# Altium schematic sheet color_sensors.SchDoc
size A; SheetNumber: 2; SheetTotal: 2
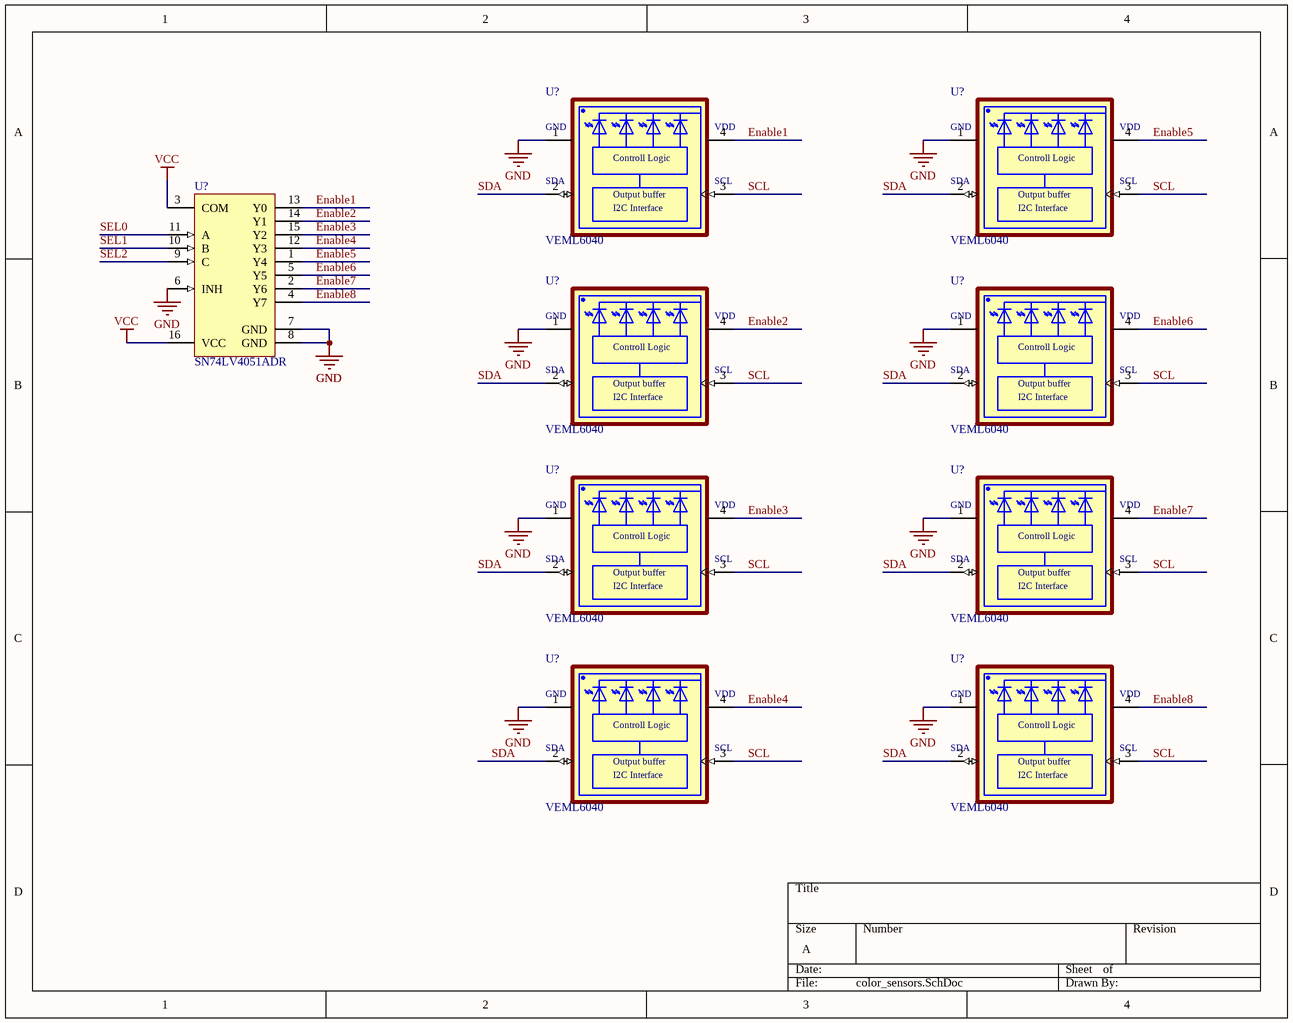
[diagram p0: color_sensors.SchDoc]

## Parts
(Parts that share a designator on the sheet are numbered #1, #2 ... from top to bottom, then left to right.)
U?#1  VEML6040  [VISHAY_VEML6040_1.25X2X1]
U?#2  VEML6040  [VISHAY_VEML6040_1.25X2X1]
U?#3  SN74LV4051ADR  [D0016A_M]
U?#4  VEML6040  [VISHAY_VEML6040_1.25X2X1]
U?#5  VEML6040  [VISHAY_VEML6040_1.25X2X1]
U?#6  VEML6040  [VISHAY_VEML6040_1.25X2X1]
U?#7  VEML6040  [VISHAY_VEML6040_1.25X2X1]
U?#8  VEML6040  [VISHAY_VEML6040_1.25X2X1]
U?#9  VEML6040  [VISHAY_VEML6040_1.25X2X1]

## Nets
GND: U?#1.1(GND) U?#2.1(GND) U?#3.6(INH) U?#3.7(GND) U?#3.8(GND) U?#4.1(GND) U?#5.1(GND) U?#6.1(GND) U?#7.1(GND) U?#8.1(GND) U?#9.1(GND)
VCC: U?#3.3(COM) U?#3.16(VCC)
Enable1: U?#1.4(VDD) U?#3.13(Y0)
Enable2: U?#3.14(Y1) U?#4.4(VDD)
Enable3: U?#3.15(Y2) U?#6.4(VDD)
Enable4: U?#3.12(Y3) U?#8.4(VDD)
Enable5: U?#2.4(VDD) U?#3.1(Y4)
Enable6: U?#3.5(Y5) U?#5.4(VDD)
Enable7: U?#3.2(Y6) U?#7.4(VDD)
Enable8: U?#3.4(Y7) U?#9.4(VDD)
SCL: U?#1.3(SCL) U?#2.3(SCL) U?#4.3(SCL) U?#5.3(SCL) U?#6.3(SCL) U?#7.3(SCL) U?#8.3(SCL) U?#9.3(SCL)
SDA: U?#1.2(SDA) U?#2.2(SDA) U?#4.2(SDA) U?#5.2(SDA) U?#6.2(SDA) U?#7.2(SDA) U?#8.2(SDA) U?#9.2(SDA)
SEL0: U?#3.11(A)
SEL1: U?#3.10(B)
SEL2: U?#3.9(C)

## Notes on the sheet
- (in symbol VEML6040) Controll Logic; Output buffer; I2C Interface

## Library data of the parts
U?#1 U?#2 U?#4-U?#9 = VEML6040: <b>VEML6040</b>  <p> RGBW Color Sensor with I2C Interface: <ul>   VEML6040 color sensor senses red, green, blue, and white light and incorporates photodiodes, amplifiers, and analog / digital circuits into a single chip using CMOS process. With the color sensor applied, the brightness, and color temperature of backlight can be adjusted base on ambient light source that makes panel looks more comfortable for end userâ€™s eyes. VEML6040â€™s adoption of FiltronTM technology achieves the closest ambient light spectral sensitivity to real human eye responses.  <ul> Device Model created 15.06.2016 by Johannes Kolb - Vishay Semiconductor GmbH; MF: {'manufacturer': u'Vishay'}; Price: None; Availability: Unavailable; Package: None; Value: *; MP: VEML6040
U?#3 = CMP-0802-00006-4: 8-Channel Analog Multiplexer/Demultiplexer, D0016A, LARGE T&R; Manufacturer: Texas Instruments; VCC(Min)(V): 2; Output Type: CMOS; VCC(Max)(V): 5.5; Bandwidth(Max)(MHz): 35; Rating: Catalog; Configuration: 1 X 1：8 MUX; Crosstalk: Yes; Ron(Max)(Ohms): 75; Ron(Typ)(Ohms): 22; PackageVersion: http://www.ti.com/lit/ml/mpds178g/mpds178g.pdf; Generic Part Number: SN74LV4051A; Operating Temperature Range(C): -40 to 85; Code_JEDEC: MS-012 variation AC; PackageReference: D0016A; DatasheetVersion: SCLS428H